# Altium schematic sheet NUCLEO-F410RB-Show.SchDoc
size A4
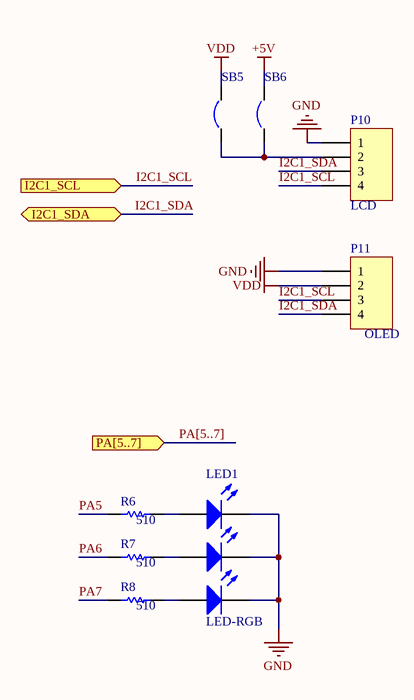
[diagram p0: NUCLEO-F410RB-Show.SchDoc]

## Parts
LED1  LED-RGB  [LED-SMD_6PIN-L1.60-W1.50-BL-RD]
P10  LCD  [HDR1X4]
P11  OLED  [HDR1X4]
R6  value 510  [R0603]  (hidden comment: Res_US)
R7  value 510  [R0603]  (hidden comment: Res_US)
R8  value 510  [R0603]  (hidden comment: Res_US)
SB5  Circuit Breaker  [JP2_SMD]  (value not drawn)
SB6  Circuit Breaker  [JP2_SMD]  (value not drawn)

## Ports
I2C1_SCL (in), I2C1_SDA (bidir), PA[5..7] (in)

## Nets
+5V: SB6.2
GND: LED1.4(K) LED1.5(K) LED1.6(K) P10.1 P11.1
VDD: P11.2 SB5.2
I2C1_SCL: P10.4 P11.3 ; port I2C1_SCL
I2C1_SDA: P10.3 P11.4 ; port I2C1_SDA
PA5: R6.2
PA6: R7.2
PA7: R8.2
NetLED1_1: LED1.1(A) R6.1
NetLED1_2: LED1.2(A) R7.1
NetLED1_3: LED1.3(A) R8.1
NetP10_2: P10.2 SB5.1 SB6.1

## Buses and harness runs
bus PA[5..7] = port PA[5..7]

## Library data of the parts
LED1 = LED-RGB: Typical INFRARED GaAs LED; Published: 8-Jun-2000; LatestRevisionDate: 08-Jul-2005; LatestRevisionNote: Mech Layer 1 removed.; PackageReference: LED-0; Publisher: Altium Limited; PackageDescription: LED; 2 Leads
P10 P11 = Header 4: Header, 4-Pin; LatestRevisionDate: 17-Jul-2002; LatestRevisionNote: Re-released for DXP Platform.; Publisher: Altium Limited
R6-R8 = Res_US: Resistor; Published: 8-Jun-2000; LatestRevisionDate: 29-May-2009; LatestRevisionNote: IPC-7351 Footprint Added.; PackageReference: J1-0603; Publisher: Altium Limited; PackageDescription: Chip Resistor
SB5 SB6 = Circuit Breaker: Solder: NO; Published: 24-Mar-1999; Revision: July-2002: Re-released for DXP Platform.; Publisher: Altium Limited